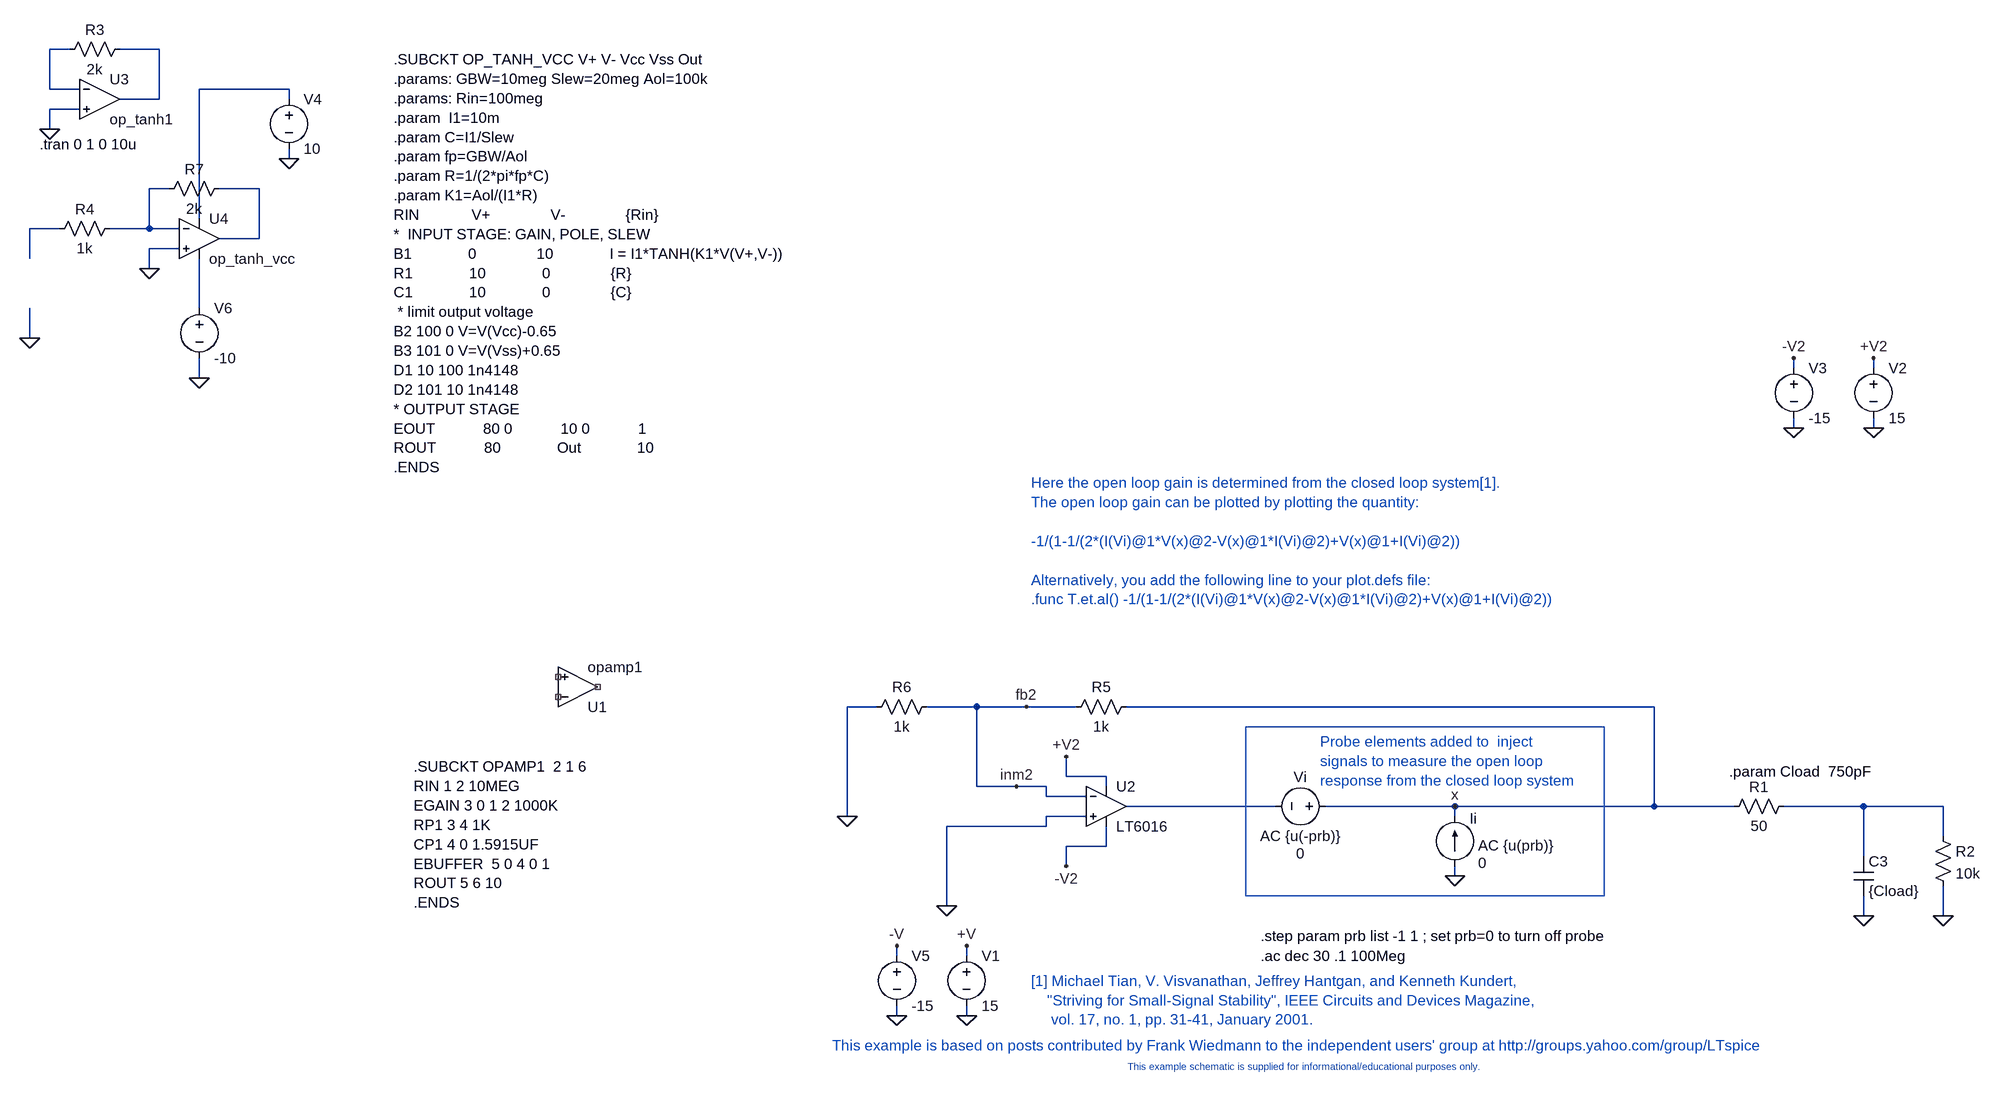
[diagram p0: schematic amp loop gain .asc]
amp loop gain .asc, the LTspice schematic file:
Version 4
SHEET 1 2404 1300
WIRE -1552 -1040 -1584 -1040
WIRE -1408 -1040 -1472 -1040
WIRE -1584 -976 -1584 -1040
WIRE -1536 -976 -1584 -976
WIRE -1200 -976 -1344 -976
WIRE -1408 -960 -1408 -1040
WIRE -1408 -960 -1472 -960
WIRE -1200 -960 -1200 -976
WIRE -1536 -944 -1584 -944
WIRE -1584 -912 -1584 -944
WIRE -1200 -864 -1200 -880
WIRE -1392 -816 -1424 -816
WIRE -1248 -816 -1312 -816
WIRE -1344 -768 -1344 -976
WIRE -1568 -752 -1616 -752
WIRE -1424 -752 -1424 -816
WIRE -1424 -752 -1488 -752
WIRE -1376 -752 -1424 -752
WIRE -1248 -736 -1248 -816
WIRE -1248 -736 -1312 -736
WIRE -1376 -720 -1424 -720
WIRE -1616 -704 -1616 -752
WIRE -1424 -688 -1424 -720
WIRE -1344 -624 -1344 -704
WIRE -1616 -576 -1616 -624
WIRE 1216 -528 1216 -544
WIRE 1344 -528 1344 -544
WIRE -1344 -512 -1344 -544
WIRE 1216 -432 1216 -448
WIRE 1344 -432 1344 -448
WIRE -256 16 -304 16
WIRE -96 16 -176 16
WIRE -16 16 -96 16
WIRE 64 16 -16 16
WIRE 992 16 144 16
WIRE 48 128 48 96
WIRE 112 128 48 128
WIRE -96 144 -96 16
WIRE -32 144 -96 144
WIRE 16 144 -32 144
WIRE 112 144 112 128
WIRE 16 160 16 144
WIRE 80 160 16 160
WIRE 384 176 144 176
WIRE 672 176 464 176
WIRE 992 176 992 16
WIRE 992 176 672 176
WIRE 1120 176 992 176
WIRE 1328 176 1200 176
WIRE 1456 176 1328 176
WIRE -304 192 -304 16
WIRE 80 192 16 192
WIRE 672 192 672 176
WIRE 16 208 16 192
WIRE 16 208 -144 208
WIRE 1456 224 1456 176
WIRE 112 240 112 208
WIRE 112 240 48 240
WIRE 1328 256 1328 176
WIRE 48 272 48 240
WIRE 672 288 672 272
WIRE -144 336 -144 208
WIRE 1328 352 1328 320
WIRE 1456 352 1456 304
WIRE -224 416 -224 400
WIRE -112 416 -112 400
WIRE -224 512 -224 496
WIRE -112 512 -112 496
FLAG -112 512 0
FLAG -112 400 +V
FLAG -224 512 0
FLAG -224 400 -V
FLAG 672 288 0
FLAG 672 176 x
FLAG 1344 -432 0
FLAG 48 96 +V2
FLAG 1344 -544 +V2
FLAG 48 272 -V2
FLAG 1216 -432 0
FLAG 1216 -544 -V2
FLAG -144 336 0
FLAG 1328 352 0
FLAG -16 16 fb2
FLAG -32 144 inm2
FLAG -304 192 0
FLAG 1456 352 0
FLAG -1584 -912 0
FLAG -1424 -688 0
FLAG -1616 -576 0
FLAG -1200 -864 0
FLAG -1344 -512 0
SYMBOL voltage -112 400 R0
WINDOW 123 0 0 Left 2
WINDOW 39 0 0 Left 2
SYMATTR InstName V1
SYMATTR Value 15
SYMBOL voltage -224 400 R0
WINDOW 123 0 0 Left 2
WINDOW 39 0 0 Left 2
SYMATTR InstName V5
SYMATTR Value -15
SYMBOL current 672 272 M180
WINDOW 0 24 77 Left 2
WINDOW 3 37 5 Left 2
WINDOW 123 37 33 Left 2
WINDOW 39 0 0 Left 2
SYMATTR InstName Ii
SYMATTR Value 0
SYMATTR Value2 AC {u(prb)}
SYMBOL voltage 480 176 M270
WINDOW 0 32 56 VTop 2
WINDOW 3 -60 56 VBottom 2
WINDOW 123 -32 56 VBottom 2
WINDOW 39 -32 56 VBottom 2
SYMATTR InstName Vi
SYMATTR Value 0
SYMATTR Value2 AC {u(-prb)}
SYMBOL voltage 1344 -544 R0
WINDOW 123 0 0 Left 2
WINDOW 39 0 0 Left 2
SYMATTR InstName V2
SYMATTR Value 15
SYMBOL voltage 1216 -544 R0
WINDOW 123 0 0 Left 2
WINDOW 39 0 0 Left 2
SYMATTR InstName V3
SYMATTR Value -15
SYMBOL res 160 0 R90
WINDOW 0 0 56 VBottom 2
WINDOW 3 32 56 VTop 2
SYMATTR InstName R5
SYMATTR Value 1k
SYMBOL cap 1312 256 R0
SYMATTR InstName C3
SYMATTR Value {Cload}
SYMBOL res -160 0 R90
WINDOW 0 0 56 VBottom 2
WINDOW 3 32 56 VTop 2
SYMATTR InstName R6
SYMATTR Value 1k
SYMBOL Opamps\\LT6016 112 176 R0
SYMATTR InstName U2
SYMBOL res 1216 160 R90
WINDOW 0 0 56 VBottom 2
WINDOW 3 32 56 VTop 2
SYMATTR InstName R1
SYMATTR Value 50
SYMBOL res 1440 208 R0
SYMATTR InstName R2
SYMATTR Value 10k
SYMBOL Opamps\\opamp -736 48 M180
SYMATTR InstName U1
SYMATTR SpiceLine ""
SYMATTR Value opamp1
SYMATTR SpiceLine2 ""
SYMBOL Opamps\\opamp -1504 -1024 R0
SYMATTR InstName U3
SYMATTR Value op_tanh1
SYMATTR SpiceLine GBW=1meg Slew=1meg Aol=100k Rin=100meg
SYMATTR SpiceLine2 ""
SYMBOL res -1456 -1056 R90
WINDOW 0 0 56 VBottom 2
WINDOW 3 32 56 VTop 2
SYMATTR InstName R3
SYMATTR Value 2k
SYMBOL res -1472 -768 R90
WINDOW 0 0 56 VBottom 2
WINDOW 3 32 56 VTop 2
SYMATTR InstName R4
SYMATTR Value 1k
SYMBOL res -1296 -832 R90
WINDOW 0 0 56 VBottom 2
WINDOW 3 32 56 VTop 2
SYMATTR InstName R7
SYMATTR Value 2k
SYMBOL Opamps\\opamp2 -1344 -800 R0
SYMATTR InstName U4
SYMATTR Value op_tanh_vcc
SYMBOL voltage -1200 -976 R0
WINDOW 123 0 0 Left 2
WINDOW 39 0 0 Left 2
SYMATTR InstName V4
SYMATTR Value 10
SYMBOL voltage -1344 -640 R0
WINDOW 123 0 0 Left 2
WINDOW 39 0 0 Left 2
SYMATTR InstName V6
SYMATTR Value -10
TEXT 360 416 Left 2 !.ac dec 30 .1 100Meg
TEXT -8 -344 Left 2 ;Here the open loop gain is determined from the closed loop system[1].\nThe open loop gain can be plotted by plotting the quantity:\n \n-1/(1-1/(2*(I(Vi)@1*V(x)@2-V(x)@1*I(Vi)@2)+V(x)@1+I(Vi)@2))\n \nAlternatively, you add the following line to your plot.defs file:\n.func T.et.al() -1/(1-1/(2*(I(Vi)@1*V(x)@2-V(x)@1*I(Vi)@2)+V(x)@1+I(Vi)@2))
TEXT 432 584 Top 1 ;This example schematic is supplied for informational/educational purposes only.
TEXT -8 456 Left 2 ;[1] Michael Tian, V. Visvanathan, Jeffrey Hantgan, and Kenneth Kundert,\n    "Striving for Small-Signal Stability", IEEE Circuits and Devices Magazine,\n     vol. 17, no. 1, pp. 31-41, January 2001.
TEXT 360 384 Left 2 !.step param prb list -1 1 ; set prb=0 to turn off probe
TEXT 456 72 Left 2 ;Probe elements added to  inject\nsignals to measure the open loop\nresponse from the closed loop system
TEXT -328 560 Left 2 ;This example is based on posts contributed by Frank Wiedmann to the independent users' group at http://groups.yahoo.com/group/LTspice
TEXT 1112 120 Left 2 !.param Cload  750pF
TEXT -1000 112 Left 2 !.SUBCKT OPAMP1  2 1 6\nRIN 1 2 10MEG\nEGAIN 3 0 1 2 1000K\nRP1 3 4 1K\nCP1 4 0 1.5915UF\nEBUFFER  5 0 4 0 1\nROUT 5 6 10\n.ENDS
TEXT -1600 -888 Left 2 !.tran 0 1 0 10u
TEXT -1032 -1024 Left 2 !.SUBCKT OP_TANH_VCC V+ V- Vcc Vss Out \n.params: GBW=10meg Slew=20meg Aol=100k \n.params: Rin=100meg \n.param  I1=10m\n.param C=I1/Slew\n.param fp=GBW/Aol\n.param R=1/(2*pi*fp*C)\n.param K1=Aol/(I1*R)\nRIN             V+               V-               {Rin}\n*  INPUT STAGE: GAIN, POLE, SLEW\nB1              0               10              I = I1*TANH(K1*V(V+,V-))\nR1              10              0               {R}\nC1              10              0               {C}\n * limit output voltage\nB2 100 0 V=V(Vcc)-0.65\nB3 101 0 V=V(Vss)+0.65\nD1 10 100 1n4148\nD2 101 10 1n4148\n* OUTPUT STAGE\nEOUT            80 0            10 0            1\nROUT            80              Out              10\n.ENDS
RECTANGLE Normal 912 320 336 48

The netlist it stands for:
* amp loop gain .asc
V1 +V 0 15
V5 -V 0 -15
Ii 0 x 0 AC {u(prb)}
Vi x N008 0 AC {u(-prb)}
V2 +V2 0 15
V3 -V2 0 -15
R5 x inm2 1k
C3 N009 0 {Cload}
R6 inm2 0 1k
* U2: LT6016 (symbol Opamps\LT6016 not available, pins judged from their places): In+=0 In-=inm2 V+=+V2 V-=-V2 OUT=N008
R1 N009 x 50
R2 N009 0 10k
XU1 NC_01 NC_02 NC_03 opamp1  ; pins invin noninvin out
XU3 N001 0 N002 op_tanh1 GBW=1meg Slew=1meg Aol=100k Rin=100meg  ; pins invin noninvin out
R3 N002 N001 2k
R4 N004 N006 1k
R7 N005 N004 2k
XU4 0 N004 N003 N007 N005 op_tanh_vcc  ; pins In+ In- V+ V- OUT
V4 N003 0 10
V6 N007 0 -10
.ac dec 30 .1 100Meg
* Here the open loop gain is determined from the closed loop system[1].
* The open loop gain can be plotted by plotting the quantity:
* -1/(1-1/(2*(I(Vi)@1*V(x)@2-V(x)@1*I(Vi)@2)+V(x)@1+I(Vi)@2))
* Alternatively, you add the following line to your plot.defs file:
* .func T.et.al() -1/(1-1/(2*(I(Vi)@1*V(x)@2-V(x)@1*I(Vi)@2)+V(x)@1+I(Vi)@2))
* This example schematic is supplied for informational/educational purposes only.
* [1] Michael Tian, V. Visvanathan, Jeffrey Hantgan, and Kenneth Kundert,
*     "Striving for Small-Signal Stability", IEEE Circuits and Devices Magazine,
*      vol. 17, no. 1, pp. 31-41, January 2001.
.step param prb list -1 1 ; set prb=0 to turn off probe
* Probe elements added to  inject
* signals to measure the open loop
* response from the closed loop system
* This example is based on posts contributed by Frank Wiedmann to the independent users' group at http://groups.yahoo.com/group/LTspice
.param Cload  750pF
.SUBCKT OPAMP1  2 1 6
RIN 1 2 10MEG
EGAIN 3 0 1 2 1000K
RP1 3 4 1K
CP1 4 0 1.5915UF
EBUFFER  5 0 4 0 1
ROUT 5 6 10
.ENDS
.tran 0 1 0 10u
.SUBCKT OP_TANH_VCC V+ V- Vcc Vss Out
.params: GBW=10meg Slew=20meg Aol=100k
.params: Rin=100meg
.param  I1=10m
.param C=I1/Slew
.param fp=GBW/Aol
.param R=1/(2*pi*fp*C)
.param K1=Aol/(I1*R)
RIN             V+               V-               {Rin}
*  INPUT STAGE: GAIN, POLE, SLEW
B1              0               10              I = I1*TANH(K1*V(V+,V-))
R1              10              0               {R}
C1              10              0               {C}
 * limit output voltage
B2 100 0 V=V(Vcc)-0.65
B3 101 0 V=V(Vss)+0.65
D1 10 100 1n4148
D2 101 10 1n4148
* OUTPUT STAGE
EOUT            80 0            10 0            1
ROUT            80              Out              10
.ENDS
.backanno
.end